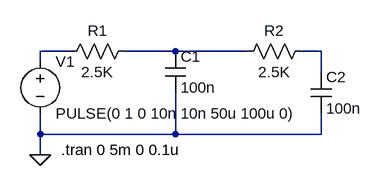
[diagram p0: schematic RC Filter.asc]
RC Filter.asc, the LTspice schematic file:
Version 4
SHEET 1 880 680
WIRE 48 176 0 176
WIRE 208 176 128 176
WIRE 320 176 208 176
WIRE 432 176 400 176
WIRE 0 192 0 176
WIRE 432 208 432 176
WIRE 0 304 0 272
WIRE 208 304 208 240
WIRE 208 304 0 304
WIRE 432 304 432 272
WIRE 432 304 208 304
WIRE 0 336 0 304
FLAG 0 336 0
SYMBOL res 144 160 R90
WINDOW 0 0 56 VBottom 2
WINDOW 3 32 56 VTop 2
SYMATTR InstName R1
SYMATTR Value 2.5K
SYMBOL cap 192 176 R0
SYMATTR InstName C1
SYMATTR Value 100n
SYMBOL voltage 0 176 R0
WINDOW 123 0 0 Left 2
WINDOW 39 0 0 Left 2
SYMATTR InstName V1
SYMATTR Value PULSE(0 1 0 10n 10n 50u 100u 0)
SYMBOL res 416 160 R90
WINDOW 0 0 56 VBottom 2
WINDOW 3 32 56 VTop 2
SYMATTR InstName R2
SYMATTR Value 2.5K
SYMBOL cap 416 208 R0
SYMATTR InstName C2
SYMATTR Value 100n
TEXT 32 328 Left 2 !.tran 0 5m 0 0.1u

The netlist it stands for:
* RC Filter.asc
R1 N002 N001 2.5K
C1 N002 0 100n
V1 N001 0 PULSE(0 1 0 10n 10n 50u 100u 0)
R2 N003 N002 2.5K
C2 N003 0 100n
.tran 0 5m 0 0.1u
.backanno
.end